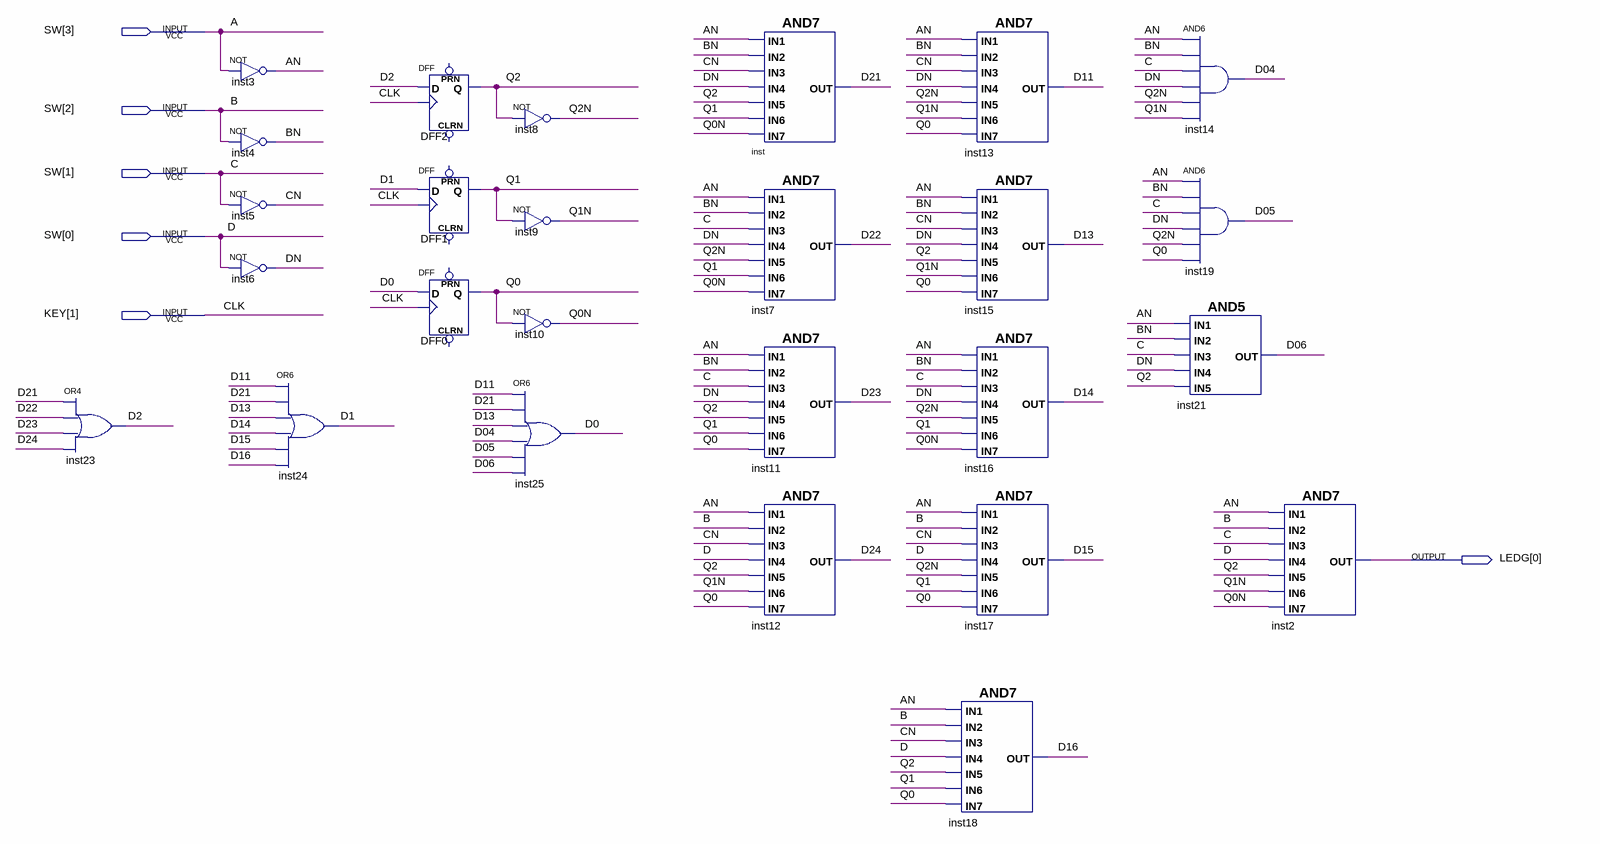
[diagram p0: schematic sheet]
// Quartus schematic LAB2_MEALY.bdf as structural Verilog: 26 symbols, 6 pins
module LAB2_MEALY (
  input  [3:0] SW,
  input  [1:1] KEY,
  output [0:0] LEDG
);

  wire AN, BN, CN, D0, D1, D2, D04, D05, D06, D11, D13, D14, D15, D16, D21, D22, D23, D24, DN, Q0, Q0N, Q1,
       Q1N, Q2, Q2N;

  or inst23 (D2, D21, D22, D23, D24);
  not inst3 (AN, SW[3]);
  not inst4 (BN, SW[2]);
  not inst5 (CN, SW[1]);
  not inst6 (DN, SW[0]);
  or inst24 (D1, D11, D21, D13, D14, D15, D16);
  DFF DFF2 (.CLK(KEY[1]), .D(D2), .Q(Q2));  // open: CLRN, PRN
  DFF DFF1 (.CLK(KEY[1]), .D(D1), .Q(Q1));  // open: CLRN, PRN
  DFF DFF0 (.CLK(KEY[1]), .D(D0), .Q(Q0));  // open: CLRN, PRN
  not inst8 (Q2N, Q2);
  not inst9 (Q1N, Q1);
  not inst10 (Q0N, Q0);
  or inst25 (D0, D11, D21, D13, D04, D05, D06);
  and inst (D21, AN, BN, CN, DN, Q2, Q1, Q0N);
  and inst7 (D22, AN, BN, SW[1], DN, Q2N, Q1, Q0N);
  and inst11 (D23, AN, BN, SW[1], DN, Q2, Q1, Q0);
  and inst12 (D24, AN, SW[2], CN, SW[0], Q2, Q1N, Q0);
  and inst13 (D11, AN, BN, CN, DN, Q2N, Q1N, Q0);
  and inst15 (D13, AN, BN, CN, DN, Q2, Q1N, Q0);
  and inst16 (D14, AN, BN, SW[1], DN, Q2N, Q1, Q0N);
  and inst17 (D15, AN, SW[2], CN, SW[0], Q2N, Q1, Q0);
  and inst18 (D16, AN, SW[2], CN, SW[0], Q2, Q1, Q0);
  and inst14 (D04, AN, BN, SW[1], DN, Q2N, Q1N);
  and inst19 (D05, AN, BN, SW[1], DN, Q2N, Q0);
  and inst21 (D06, AN, BN, SW[1], DN, Q2);
  and inst2 (LEDG[0], AN, SW[2], SW[1], SW[0], Q2, Q1N, Q0N);

  // Other names for the same wires on the sheet: CLK = KEY[1]; D = SW[0]; C = SW[1]; B = SW[2]; A = SW[3]
endmodule
